# Altium schematic sheet EEG AFE Sheet 1.SchDoc
size 381 x 241 mm; SheetNumber: 1; SheetTotal: 4
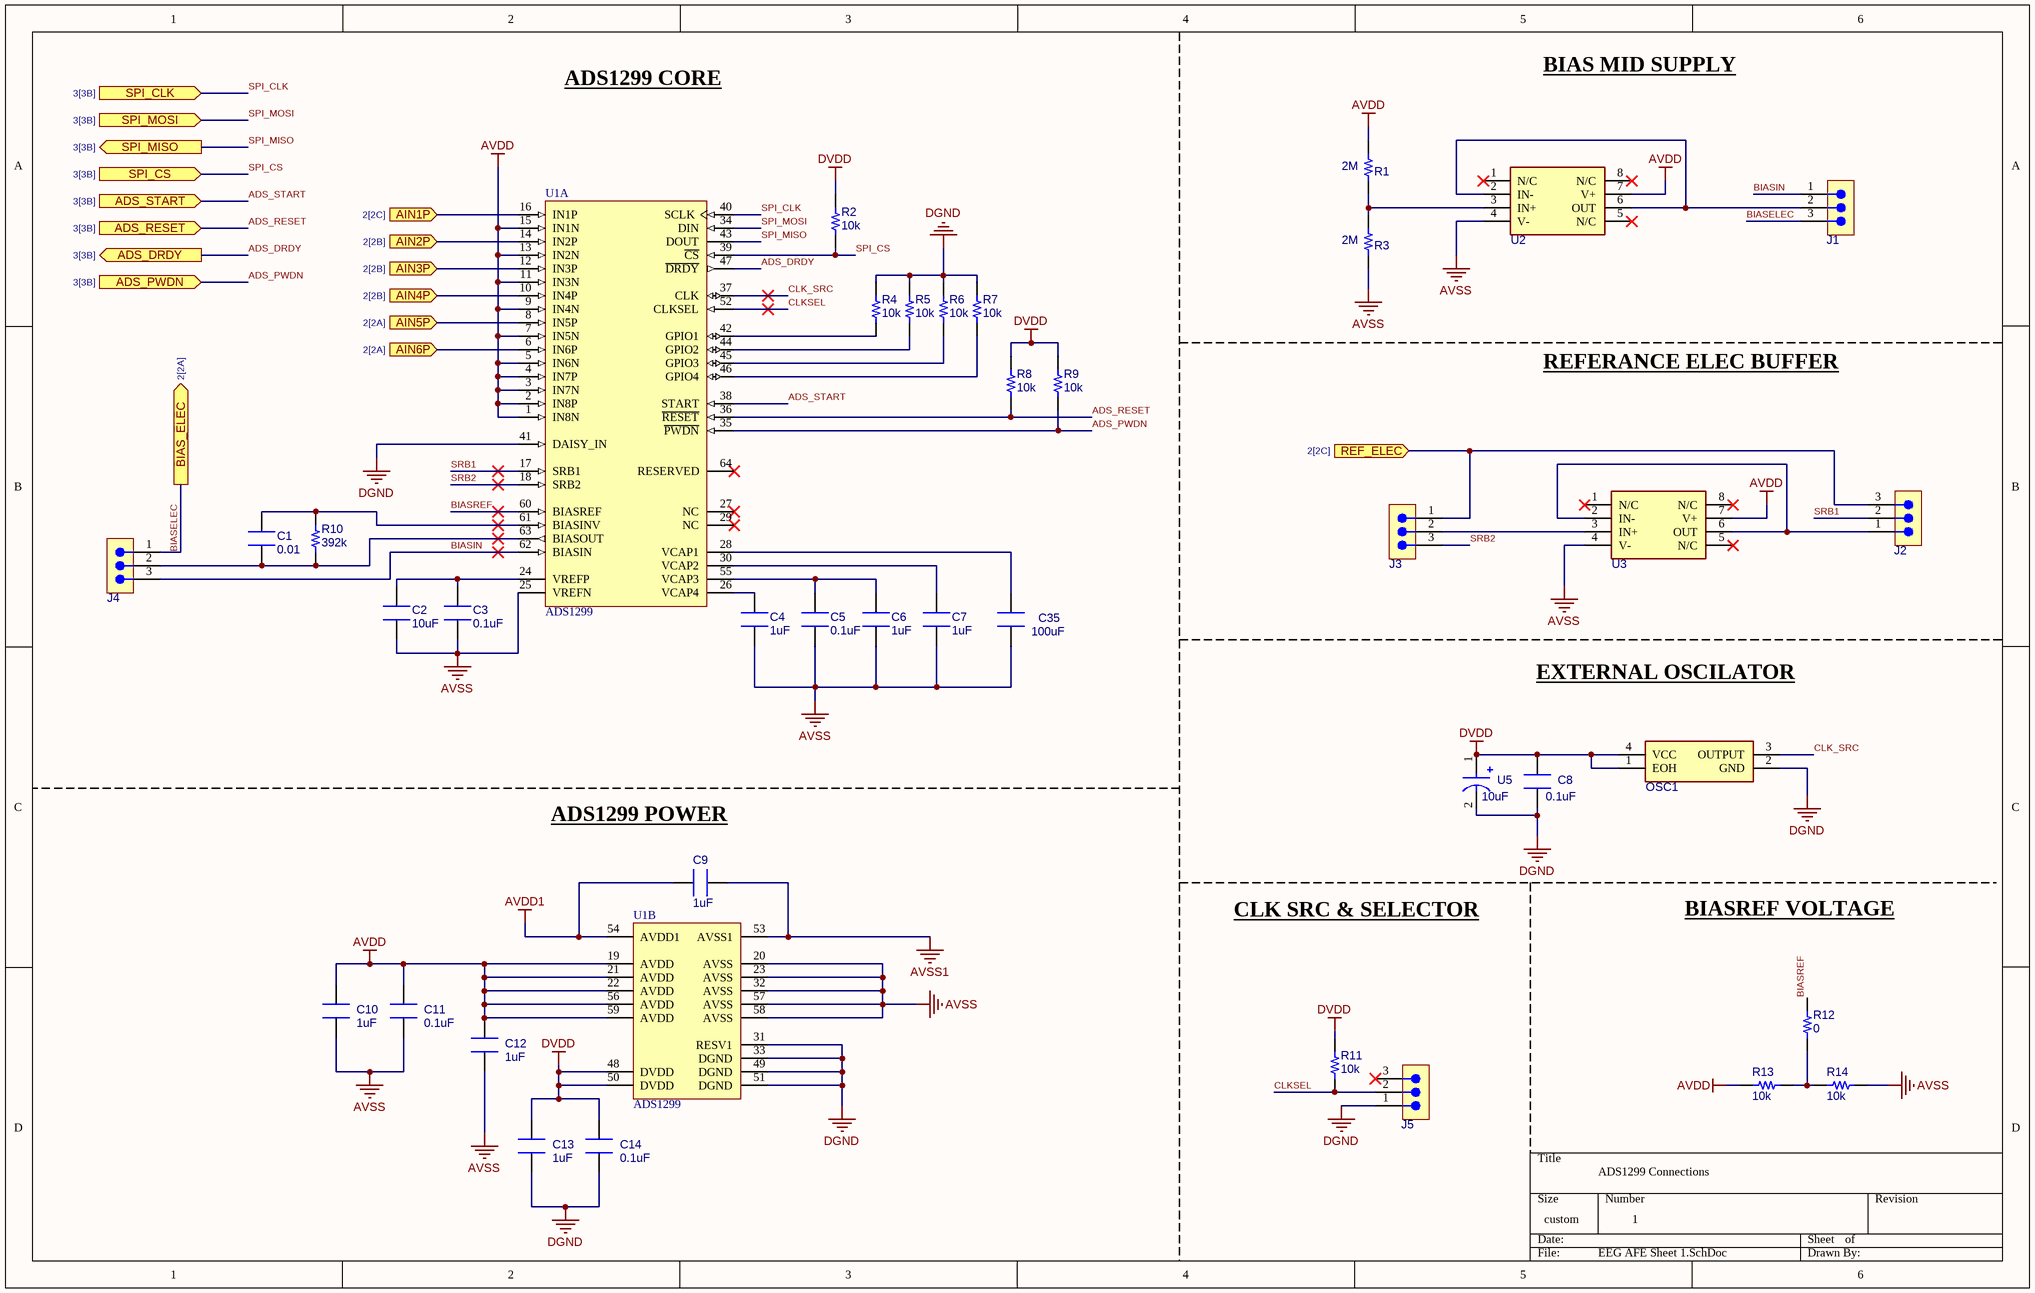
[diagram p0: EEG AFE Sheet 1.SchDoc]

## Parts
C1  0.01  [CAP 0603_1608]
C2  10uF  [CAP0805]
C3  0.1uF  [CAP 0603_1608]
C4  1uF  [CAP 0603_1608]
C5  0.1uF  [CAP 0603_1608]
C6  1uF  [CAP 0603_1608]
C7  1uF  [CAP 0603_1608]
C8  0.1uF  [CAP 0603_1608]
C9  1uF  [CAP 0603_1608]
C10  1uF  [CAP 0603_1608]
C11  0.1uF  [CAP 0603_1608]
C12  1uF  [CAP 0603_1608]
C13  1uF  [CAP 0603_1608]
C14  0.1uF  [CAP 0603_1608]
C35  100uF  [CAP1210]
J1  *  [SMTC-TSW-103-07-X-S]  (value not drawn)
J2  *  [SMTC-TSW-103-07-X-S]  (value not drawn)
J3  *  [SMTC-TSW-103-07-X-S]  (value not drawn)
J4  *  [SMTC-TSW-103-07-X-S]  (value not drawn)
J5  *  [SMTC-TSW-103-07-X-S]  (value not drawn)
OSC1  *  [632L3I002M04800]  (value not drawn)
R1  2M  [RES 0603_1608]
R2  10k  [RES 0603_1608]
R3  2M  [RES 0603_1608]
R4  10k  [RES 0603_1608]
R5  10k  [RES 0603_1608]
R6  10k  [RES 0603_1608]
R7  10k  [RES 0603_1608]
R8  10k  [RES 0603_1608]
R9  10k  [RES 0603_1608]
R10  392k  [RES 0603_1608]
R11  10k  [RES 0603_1608]
R12  0  [RES 0603_1608]
R13  10k  [RES 0603_1608]
R14  10k  [RES 0603_1608]
U1  ADS1299  [TI-PAG64_N]  (parts A,B of 2)
U2  *  [SOIC127P600X175-8N]  (value not drawn)
U3  *  [SOIC127P600X175-8N]  (value not drawn)
U5  10uF  [CAPC0805_TANT]

## Ports
ADS_DRDY (out, see 3[3B]), ADS_PWDN (in, see 3[3B]), ADS_RESET (in, see 3[3B]), ADS_START (in, see 3[3B]), AIN1P (in, see 2[2C]), AIN2P (in, see 2[2B]), AIN3P (in, see 2[2B]), AIN4P (in, see 2[2B]), AIN5P (in, see 2[2A]), AIN6P (in, see 2[2A]), BIAS_ELEC (out, see 2[2A]), REF_ELEC (in, see 2[2C]), SPI_CLK (in, see 3[3B]), SPI_CS (in, see 3[3B]), SPI_MISO (out, see 3[3B]), SPI_MOSI (in, see 3[3B])

## Nets
AVDD: C10.2 C11.2 C12.2 R1.2 R13.2 U1.1(IN8N) U1.2(IN8P) U1.3(IN7N) U1.4(IN7P) U1.5(IN6N) U1.7(IN5N) U1.9(IN4N) U1.11(IN3N) U1.13(IN2N) U1.15(IN1N) U1.19(AVDD) U1.21(AVDD) U1.22(AVDD) U1.56(AVDD) U1.59(AVDD) U2.7(V+) U3.7(V+)
AVDD1: C9.2 U1.54(AVDD1)
AVSS: C2.2 C3.2 C4.2 C5.2 C6.2 C7.2 C10.1 C11.1 C12.1 C35.1 R3.1 R14.1 U1.20(AVSS) U1.23(AVSS) U1.25(VREFN) U1.32(AVSS) U1.57(AVSS) U1.58(AVSS) U2.4(V-) U3.4(V-)
AVSS1: C9.1 U1.53(AVSS1)
DGND: C8.1 C13.1 C14.1 J5.1 OSC1.2(GND) R4.2 R5.2 R6.2 R7.2 U1.31(RESV1) U1.33(DGND) U1.41(DAISY_IN) U1.49(DGND) U1.51(DGND) U5.2(A)
DVDD: C8.2 C13.2 C14.2 OSC1.1(EOH) OSC1.4(VCC) R2.2 R8.1 R9.1 R11.2 U1.48(DVDD) U1.50(DVDD) U5.1(C)
ADS_DRDY: U1.47(~{DRDY}) ; port ADS_DRDY
ADS_PWDN: R9.2 U1.35(~{PWDN}) ; port ADS_PWDN
ADS_RESET: R8.2 U1.36(~{RESET}) ; port ADS_RESET
ADS_START: U1.38(START) ; port ADS_START
AIN1P: U1.16(IN1P) ; port AIN1P
AIN2P: U1.14(IN2P) ; port AIN2P
AIN3P: U1.12(IN3P) ; port AIN3P
AIN4P: U1.10(IN4P) ; port AIN4P
AIN5P: U1.8(IN5P) ; port AIN5P
AIN6P: U1.6(IN6P) ; port AIN6P
BIASELEC: J1.3 J4.1 ; port BIAS_ELEC
BIASIN: J1.1 J4.3 U1.62(BIASIN)
BIASREF: R12.1 U1.60(BIASREF)
CLK_SRC: OSC1.3(OUTPUT) U1.37(CLK)
CLKSEL: J5.2 R11.1 U1.52(CLKSEL)
REF_ELEC: J2.3 J3.1 ; port REF_ELEC
SPI_CLK: U1.40(SCLK) ; port SPI_CLK
SPI_CS: R2.1 U1.39(~{CS}) ; port SPI_CS
SPI_MISO: U1.43(DOUT) ; port SPI_MISO
SPI_MOSI: U1.34(DIN) ; port SPI_MOSI
SRB1: J2.2 U1.17(SRB1)
SRB2: J3.3 U1.18(SRB2)
NetC1_1: C1.1 R10.1 U1.61(BIASINV)
NetC1_2: C1.2 J4.2 R10.2 U1.63(BIASOUT)
NetC2_1: C2.1 C3.1 U1.24(VREFP)
NetC4_1: C4.1 U1.26(VCAP4)
NetC5_1: C5.1 C6.1 U1.55(VCAP3)
NetC7_1: C7.1 U1.30(VCAP2)
NetC35_2: C35.2 U1.28(VCAP1)
NetJ1_2: J1.2 U2.2(IN-) U2.6(OUT)
NetJ2_1: J2.1 U3.2(IN-) U3.6(OUT)
NetJ3_2: J3.2 U3.3(IN+)
NetR1_1: R1.1 R3.2 U2.3(IN+)
NetR4_1: R4.1 U1.42(GPIO1)
NetR5_1: R5.1 U1.44(GPIO2)
NetR6_1: R6.1 U1.45(GPIO3)
NetR7_1: R7.1 U1.46(GPIO4)
NetR12_2: R12.2 R13.1 R14.2

Not connected (* = marked no-connect by the designer): J5 3*; U1 27(NC)* 29(NC)* 64(RESERVED)*; U2 1(N/C)* 5(N/C)* 8(N/C)*; U3 1(N/C)* 5(N/C)* 8(N/C)*

## Notes on the sheet
- ADS1299 CORE
- BIAS MID SUPPLY
- REFERANCE ELEC BUFFER
- EXTERNAL OSCILATOR
- ADS1299 POWER
- CLK SRC & SELECTOR
- BIASREF VOLTAGE
- ADS1299 Connections
- 1

## Library data of the parts
C1-C14 = 08055C104KAT2A: Ceramic Capacitor, Multilayer, Ceramic, 50V, 10% +Tol, 10% -Tol, X7R, 15% TC, 0.1uF, Surface Mount, 0805; Manufacturer: ???; Capacitance: 100nF; Multilayer: Yes; Part Number: *; Value: *; Voltage: *; Tolerance: *; ComponentLink1Description: Datasheet; Current Rating: *; Supplier 1: Mouser; Manufacturer Part Number: 08055C104KAT2A; RoHS: Yes; Category: Ceramic Capacitors; Stock 1: 1865681; Pricing 1: 1=0.1, 10=0.037, 50=0.037, 100=0.022, 1000=0.017, 10000=0.013 (USD); Mount: Surface Mount; Number of Pins: 2; Dielectric Material: Ceramic; Package Shape: Rectangular; Size Code: 0805; Terminal Finish: Nickel; Min Operating Temperature: -55°C; Max Operating Temperature: 125°C; JESD-609 Code: e3; Capacitor Type: Ceramic; Negative Tolerance: 10%; Package Style: SMTMeter; Packaging: Tape and Reel; Positive Tolerance: 10%; Rated DC Voltage (URdc): 50V; Temperature Characteristics Code: X7R; Termination: Wraparound; Length: 2.01mm; Width: 1.25mm; Height: 0.94mm; Reach SVHC Compliant: Yes; RoHS Compliant: Yes; ComponentLink2URL: https://datasheet.ciiva.com:443/pdfs/VipMasterIC/IC/AVXC/AVXC-S-A0009640452/AVXC-S-A0009640452-1.pdf?src-supplier=IHS+Markit; ComponentLink2Description: https://datasheet.ciiva.com:443/pdfs/VipMasterIC/IC/AVXC/AVXC-S-A0009640452/AVXC-S-A0009640452-1.pdf?src-supplier=IHS+Markit; ComponentLink3URL: https://datasheet.ciiva.com/19475/2009691-19475858.pdf?src-supplier=Jameco; ComponentLink3Description: https://datasheet.ciiva.com/19475/2009691-19475858.pdf?src-supplier=Jameco; ComponentLink4URL: https://datasheet.ciiva.com/11786/0900766b802d4698-11786116.pdf?src-supplier=Rs; ComponentLink4Description: https://datasheet.ciiva.com/11786/0900766b802d4698-11786116.pdf?src-supplier=Rs; ComponentLink5URL: https://datasheet.ciiva.com/2988/cx7r-2988014.pdf?src-supplier=Avnet; ComponentLink5Description: https://datasheet.ciiva.com/2988/cx7r-2988014.pdf?src-supplier=Avnet; ComponentLink6URL: https://datasheet.ciiva.com/16199/cx7r-16199014.pdf?src-supplier=Future+Electronics; ComponentLink6Description: https://datasheet.ciiva.com/16199/cx7r-16199014.pdf?src-supplier=Future+Electronics; ComponentLink7URL: https://datasheet.ciiva.com/11504/cx7r-11504044.pdf?src-supplier=Avnet; ComponentLink7Description: https://datasheet.ciiva.com/11504/cx7r-11504044.pdf?src-supplier=Avnet; ComponentLink8URL: https://datasheet.ciiva.com/150/cx7r-150258.pdf?src-supplier=Digi-Key; ComponentLink8Description: https://datasheet.ciiva.com/150/cx7r-150258.pdf?src-supplier=Digi-Key; ComponentLink9URL: https://datasheet.ciiva.com/150/cx7r-150257.pdf?src-supplier=Digi-Key; ComponentLink9Description: https://datasheet.ciiva.com/150/cx7r-150257.pdf?src-supplier=Digi-Key; ComponentLink10URL: https://datasheet.ciiva.com/150/cx7r-150259.pdf?src-supplier=Digi-Key; ComponentLink10Description: https://datasheet.ciiva.com/150/cx7r-150259.pdf?src-supplier=Digi-Key; ComponentLink11URL: https://datasheet.ciiva.com/7812/cx7r-7812079.pdf?src-supplier=Element14; ComponentLink11Description: https://datasheet.ciiva.com/7812/cx7r-7812079.pdf?src-supplier=Element14; ComponentLink12URL: https://datasheet.ciiva.com/5416/cx7r-5416959.pdf?src-supplier=Mouser; ComponentLink12Description: https://datasheet.ciiva.com/5416/cx7r-5416959.pdf?src-supplier=Mouser; Supplier Part Number 1: 581-08055C104K
  C1 C3-C14: Package: CAP 0603_1608
  C2: Package: CAP0805
C35 = CL32A107MPVNNNE: Ceramic Capacitor, Multilayer, Ceramic, 10V, 20% +Tol, 20% -Tol, X5R, 15% TC, 100uF, Surface Mount, 1210; Manufacturer: ???; Multilayer: Yes; Package: CAP1210; Publisher: Paraqum Technologies; Part Number: *; Value: *; Voltage: *; Tolerance: *; ComponentLink1Description: Datasheet; Current Rating: *; Supplier 1: Mouser; Manufacturer Part Number: CL32A107MPVNNNE; RoHS: Yes; Category: Ceramic Capacitors; Stock 1: 59809; Pricing 1: 1=1.07, 10=0.66, 50=0.66, 100=0.581, 1000=0.386, 10000=0.325 (USD); Mount: Surface Mount; Number of Pins: 2; Dielectric Material: Ceramic; Package Shape: Rectangular; Size Code: 1210; Terminal Finish: Nickel; Min Operating Temperature: -55°C; Max Operating Temperature: 85°C; JESD-609 Code: e3; Capacitance: 100uF; Capacitor Type: Ceramic; Negative Tolerance: 20%; Package Style: SMTMeter; Packaging: Tape and Reel; Positive Tolerance: 20%; Rated DC Voltage (URdc): 10V; Temperature Characteristics Code: X5R; Termination: Wraparound; Length: 3.2mm; Width: 2.5mm; Height: 2.8mm; Reach SVHC Compliant: Yes; RoHS Compliant: Yes; ComponentLink2URL: https://datasheet.ciiva.com:443/pdfs/VipMasterIC/IC/SEMS/SEMS-S-A0008524842/SEMS-S-A0008524698-1.pdf?src-supplier=IHS+Markit; ComponentLink2Description: https://datasheet.ciiva.com:443/pdfs/VipMasterIC/IC/SEMS/SEMS-S-A0008524842/SEMS-S-A0008524698-1.pdf?src-supplier=IHS+Markit; ComponentLink3URL: https://datasheet.ciiva.com/26947/getdatasheetpartid-468228-26947022.pdf?src-supplier=Verical; ComponentLink3Description: https://datasheet.ciiva.com/26947/getdatasheetpartid-468228-26947022.pdf?src-supplier=Verical; Supplier Part Number 1: 187-CL32A107MPVNNNE
J1-J5 = TSW-103-07-T-S: Board Connector, 3 Contact(s), 1 Row(s), Male, Straight, 0.1 inch Pitch, Solder Terminal, Black Insulator, Receptacle; Manufacturer: ???; Option: General Purpose; Additional Feature: E.L.P.; Contact Pattern: RECTANGULAR; Contact Style: SQ PIN-SKT; Filter Feature: No; Mating Information: MULTIPLE MATING PARTS AVAILABLE; Number Of Connectors: 1; Number of Contacts: 3; Reference Standard: UL; Reliability: COMMERCIAL; Package: SMTC-TSW-103-07-X-S; Publisher: Paraqum Technologies; Part Number: *; Value: *; Voltage: *; Tolerance: *; ComponentLink1Description: Datasheet; Current Rating: *; Supplier 1: Mouser; Manufacturer Part Number: TSW-103-07-T-S; RoHS: Yes; Category: Connectors; Stock 1: 150268; Pricing 1: 1=0.27, 10=0.235, 50=0.235, 100=0.179, 1000=0.124, 10000=0.123 (USD); Mount: Board; Contact Material: Bronze; Contact Finish - Mating: MATTE TIN OVER NICKEL (50); Contact Finish - Termination: Tin (Sn) - with Nickel (Ni) barrier; Insulation Color: Black; Insulation Material: Glass; Connector Type: BOARD CONNECTOR; JESD-609 Code: e3; Body/Shell Style: RECEPTACLE; Contact Gender: Male; Mixed Contacts: No; Mounting Style: STRAIGHT; Number Of PCB Rows: 1; Number of Rows Loaded: 1; PCB Contact Pattern: RECTANGULAR; Termination: Solder; Body Breadth: 0.1inch; Body Depth: 0.1inch; Mating Contact Pitch: 0.1inch; Terminal Length: 0.1inch; Terminal Pitch: 2.54mm; Flammability Rating: UL94 V-0; Reach SVHC Compliant: Yes; RoHS Compliant: Yes; DIN Conformance: No; IEC Conformance: No; MIL Conformance: No; ComponentLink2URL: https://datasheet.ciiva.com:443/pdfs/VipMasterIC/IC/SAMI/SAMI-S-A0003531373/SAMI-S-A0003531373-1.pdf?src-supplier=IHS+Markit; ComponentLink2Description: https://datasheet.ciiva.com:443/pdfs/VipMasterIC/IC/SAMI/SAMI-S-A0003531373/SAMI-S-A0003531373-1.pdf?src-supplier=IHS+Markit; ComponentLink3URL: https://datasheet.ciiva.com/6890/tsw-xxx-xx-xxx-x-xx-xxx-mkt-6890268.pdf?src-supplier=Digi-Key; ComponentLink3Description: https://datasheet.ciiva.com/6890/tsw-xxx-xx-xxx-x-xx-xxx-mkt-6890268.pdf?src-supplier=Digi-Key; Supplier Part Number 1: 200-TSW10307TS
OSC1 = 632L3I002M04800: Standard Clock Oscillators 2.048MHz 3.3V 50ppm; Manufacturer: ???; Package: 632L3I002M04800; Publisher: Paraqum Technologies; Part Number: *; Value: *; Voltage: *; Tolerance: *; ComponentLink1Description: Datasheet; Current Rating: *; Supplier 1: Mouser; Manufacturer Part Number: 632L3I002M04800; RoHS: Yes; Category: Oscillators; Stock 1: 5448; Pricing 1: 1=1.4, 10=1.31, 50=1.31, 100=1.13, 1000=0.919, 10000=0.843 (USD); ComponentLink2URL: http://www.ctscorp.com/wp-content/uploads/2015/11/008-0328-0.pdf?src-supplier=Digi-Key; ComponentLink2Description: http://www.ctscorp.com/wp-content/uploads/2015/11/008-0328-0.pdf?src-supplier=Digi-Key; ComponentLink3URL: http://www.ctscorp.com/wp-content/uploads/2015/11/008-0328-0.pdf?src-supplier=Avnet; ComponentLink3Description: http://www.ctscorp.com/wp-content/uploads/2015/11/008-0328-0.pdf?src-supplier=Avnet; ComponentLink4URL: http://www.ctscorp.com/CHN/components/Datasheets/008-0328-0_A.pdf?src-supplier=Mouser; ComponentLink4Description: http://www.ctscorp.com/CHN/components/Datasheets/008-0328-0_A.pdf?src-supplier=Mouser; Supplier Part Number 1: 774-632L3I002M04800
R1-R14 = RC0805FR-0710KL: Fixed Resistor, Metal Glaze/thick Film, 0.125W, 10000ohm, 150V, 1% +/-Tol, 100ppm/Cel, Surface Mount, 0805; Manufacturer: ???; Additional Feature: LASER TRIMMABLE; Rated Power Dissipation (P): 125mW; Rated Temperature: 70°C; Resistance: 10kR; Temperature Coefficient: 100ppm/°C; Package Height: 0.5mm; Package Length: 2mm; Package Width: 1.25mm; Package: RES 0603_1608; Publisher: Paraqum Technologies; Part Number: *; Value: *; Voltage: *; Tolerance: *; ComponentLink1Description: Datasheet; Current Rating: *; Supplier 1: Mouser; Manufacturer Part Number: RC0805FR-0710KL; RoHS: Yes; Category: Chip SMD Resistors; Stock 1: 8413916; Pricing 1: 1=0.1, 10=0.034, 50=0.034, 100=0.014, 1000=0.007, 10000=0.004 (USD); Mount: Surface Mount; Number of Pins: 2; Package Shape: Rectangular; Size Code: 0805; Terminal Finish: Nickel; Min Operating Temperature: -55°C; Max Operating Temperature: 155°C; JESD-609 Code: e3; Termination: Wraparound; Resistor Type: FIXED RESISTOR; Construction: Chip; Package Style: SMTMeter; Packaging: Tape and Reel; Technology: METAL GLAZE/THICK FILM; Working Voltage: 150V; Reach SVHC Compliant: Yes; RoHS Compliant: Yes; ComponentLink2URL: https://datasheet.ciiva.com:443/pdfs/VipMasterIC/IC/YAGO/YAGO-S-A0008145938/YAGO-S-A0008145938-1.pdf?src-supplier=IHS+Markit; ComponentLink2Description: https://datasheet.ciiva.com:443/pdfs/VipMasterIC/IC/YAGO/YAGO-S-A0008145938/YAGO-S-A0008145938-1.pdf?src-supplier=IHS+Markit; ComponentLink3URL: https://datasheet.ciiva.com/46447/444164-46447563.pdf?src-supplier=Element14; ComponentLink3Description: https://datasheet.ciiva.com/46447/444164-46447563.pdf?src-supplier=Element14; ComponentLink4URL: https://datasheet.ciiva.com/2456/pyu-r-int-thick-7-2456973.pdf?src-supplier=Digi-Key; ComponentLink4Description: https://datasheet.ciiva.com/2456/pyu-r-int-thick-7-2456973.pdf?src-supplier=Digi-Key; ComponentLink5URL: https://datasheet.ciiva.com/2456/pyu-r-int-thick-7-2456974.pdf?src-supplier=Digi-Key; ComponentLink5Description: https://datasheet.ciiva.com/2456/pyu-r-int-thick-7-2456974.pdf?src-supplier=Digi-Key; ComponentLink6URL: https://datasheet.ciiva.com/2456/pyu-r-int-thick-7-2456972.pdf?src-supplier=Digi-Key; ComponentLink6Description: https://datasheet.ciiva.com/2456/pyu-r-int-thick-7-2456972.pdf?src-supplier=Digi-Key; ComponentLink7URL: https://datasheet.ciiva.com/12669/rc0805-12669688.pdf?src-supplier=Mouser; ComponentLink7Description: https://datasheet.ciiva.com/12669/rc0805-12669688.pdf?src-supplier=Mouser; ComponentLink8URL: https://datasheet.ciiva.com/16747/rc0805-16747087.pdf?src-supplier=Future+Electronics; ComponentLink8Description: https://datasheet.ciiva.com/16747/rc0805-16747087.pdf?src-supplier=Future+Electronics; Supplier Part Number 1: 603-RC0805FR-0710KL
U1 = TI-ADS1299-PAG-64: Analog to Digital Converters - ADC Low-Noise, 6-Channel, 24-Bit Analog-to-Digital Converter for Biopotential Measurements 64-TQFP -40 to 85; DIGIKEY: 296-34818-1-ND
U2 U3 = OPA376AIDR: Operational Amplifier, 1 Func, 25uV Offset-Max, CMOS, PDSO8; Manufacturer: ???; Package Body Material: Plastic; Architecture: VOLTAGE-FEEDBACK; Average Bias Current-Max (IIB): 10pA; Common-mode Reject Ratio-Nom: 90dB; Frequency Compensation: YES; Micropower: No; Number of Functions: 1; Package Equivalence Code: SOP8,.25; Power Supplies: 2.5/5V; Slew Rate-Min: 2V/µs; Max Supply Current: 1mA; Supply Voltage Limit-Max: 7V; Supply Voltage-Nom (Vsup): 2.2V; Unity Gain BW-Nom: 5.5MHz; Voltage Gain-Min: 1000000; Qualification Status: Not Qualified; Package: SOIC127P600X175-8N; Publisher: Paraqum Technologies; Part Number: *; Value: *; Voltage: *; Tolerance: *; ComponentLink1Description: Datasheet; Current Rating: *; Supplier 1: Mouser; Manufacturer Part Number: OPA376AIDR; RoHS: Yes; Category: Amplifiers - Op Amps, Buffer, Instrumentation; Stock 1: 7475; Pricing 1: 1=1.96, 10=1.77, 50=1.67, 100=1.42, 1000=0.967, 10000=0.88 (USD); Package Code: SOP; Number of Pins: 8; Package Shape: Rectangular; Terminal Finish: Nickel; Min Operating Temperature: -40°C; Max Operating Temperature: 125°C; JESD-609 Code: e4; Amplifier Type: OPERATIONAL AMPLIFIER; Bias Current-Max (IIB) @25C: 10pA; Input Offset Voltage-Max: 25uV; JESD-30 Code: R-PDSO-G8; Low-Bias: Yes; Low-Offset: Yes; Moisture Sensitivity Level: 2; Package Style: SMALL OUTLINEMeter; Packaging: Tape and Reel; Peak Reflow Temperature (Cel): 260°C; Power: No; Programmable Power: No; Slew Rate: 2V/µs; Surface Mount: Yes; Technology: CMOS; Terminal Form: Gull Wing; Terminal Position: DUAL; Wideband: No; Length: 4.9mm; Width: 3.9mm; Height - Seated (Max): 1.75mm; Terminal Pitch: 1.27mm; Temperature Grade: AUTOMOTIVE; Reach SVHC Compliant: Yes; RoHS Compliant: Yes; ComponentLink2URL: https://www.ti.com:443/lit/ds/symlink/opa2376.pdf?src-supplier=IHS+Markit; ComponentLink2Description: https://www.ti.com:443/lit/ds/symlink/opa2376.pdf?src-supplier=IHS+Markit; ComponentLink3URL: https://datasheet.ciiva.com/1813/opa2376-1813349.pdf?src-supplier=Digi-Key; ComponentLink3Description: https://datasheet.ciiva.com/1813/opa2376-1813349.pdf?src-supplier=Digi-Key; ComponentLink4URL: https://datasheet.ciiva.com/14456/opa376-14456360.pdf?src-supplier=Avnet; ComponentLink4Description: https://datasheet.ciiva.com/14456/opa376-14456360.pdf?src-supplier=Avnet; Supplier Part Number 1: 595-OPA376AIDR
U5 = TPSR105K025R4000: Tantalum Capacitor, Polarized, Tantalum (dry/solid), 25V, 10% +Tol, 10% -Tol, 1uF, Surface Mount, 0805; Manufacturer: ???; ESR (Equivalent Series Resistance): 4R; Leakage Current: 500nA; Tan Delta: 0.04; Package: CAPC0805_TANT; Publisher: Paraqum Technologies; Part Number: *; Value: *; Voltage: *; Tolerance: *; ComponentLink1Description: Datasheet; Current Rating: *; Supplier 1: Mouser; Manufacturer Part Number: TPSR105K025R4000; RoHS: Yes; Category: Tantalum Capacitors; Stock 1: 11306; Pricing 1: 1=0.93, 10=0.656, 50=0.656, 100=0.431, 1000=0.272, 10000=0.205 (USD); Mount: Surface Mount; Number of Pins: 2; Dielectric Material: Tantalum; Package Shape: Rectangular; Size Code: 0805; Terminal Finish: Nickel; Min Operating Temperature: -55°C; Max Operating Temperature: 125°C; JESD-609 Code: e3; Polarity: Polarized; Capacitance: 1uF; Capacitor Type: Tantalum; Negative Tolerance: 10%; Package Style: SMTMeter; Packaging: Tape and Reel; Positive Tolerance: 10%; Rated DC Voltage (URdc): 25V; Termination: J BEND; Length: 2.05mm; Width: 1.3mm; Height: 1.2mm; Reach SVHC Compliant: Yes; RoHS Compliant: Yes; ComponentLink2URL: https://datasheet.ciiva.com:443/pdfs/VipMasterIC/IC/AVXC/AVXC-S-A0008980848/AVXC-S-A0008980848-1.pdf?src-supplier=IHS+Markit; ComponentLink2Description: https://datasheet.ciiva.com:443/pdfs/VipMasterIC/IC/AVXC/AVXC-S-A0008980848/AVXC-S-A0008980848-1.pdf?src-supplier=IHS+Markit; ComponentLink3URL: http://www.mouser.com/ds/2/40/tps-776850.pdf?src-supplier=Mouser; ComponentLink3Description: http://www.mouser.com/ds/2/40/tps-776850.pdf?src-supplier=Mouser; ComponentLink4URL: http://global.kyocera.com/prdct/electro/pdf/capacitors/taj-ce.pdf?src-supplier=Avnet; ComponentLink4Description: http://global.kyocera.com/prdct/electro/pdf/capacitors/taj-ce.pdf?src-supplier=Avnet; ComponentLink5URL: http://datasheets.avx.com/TPS.pdf?src-supplier=Digi-Key; ComponentLink5Description: http://datasheets.avx.com/TPS.pdf?src-supplier=Digi-Key; Supplier Part Number 1: 581-TPSR105K025R4000